# EAGLE design untitled (EAGLE 9.6.2)
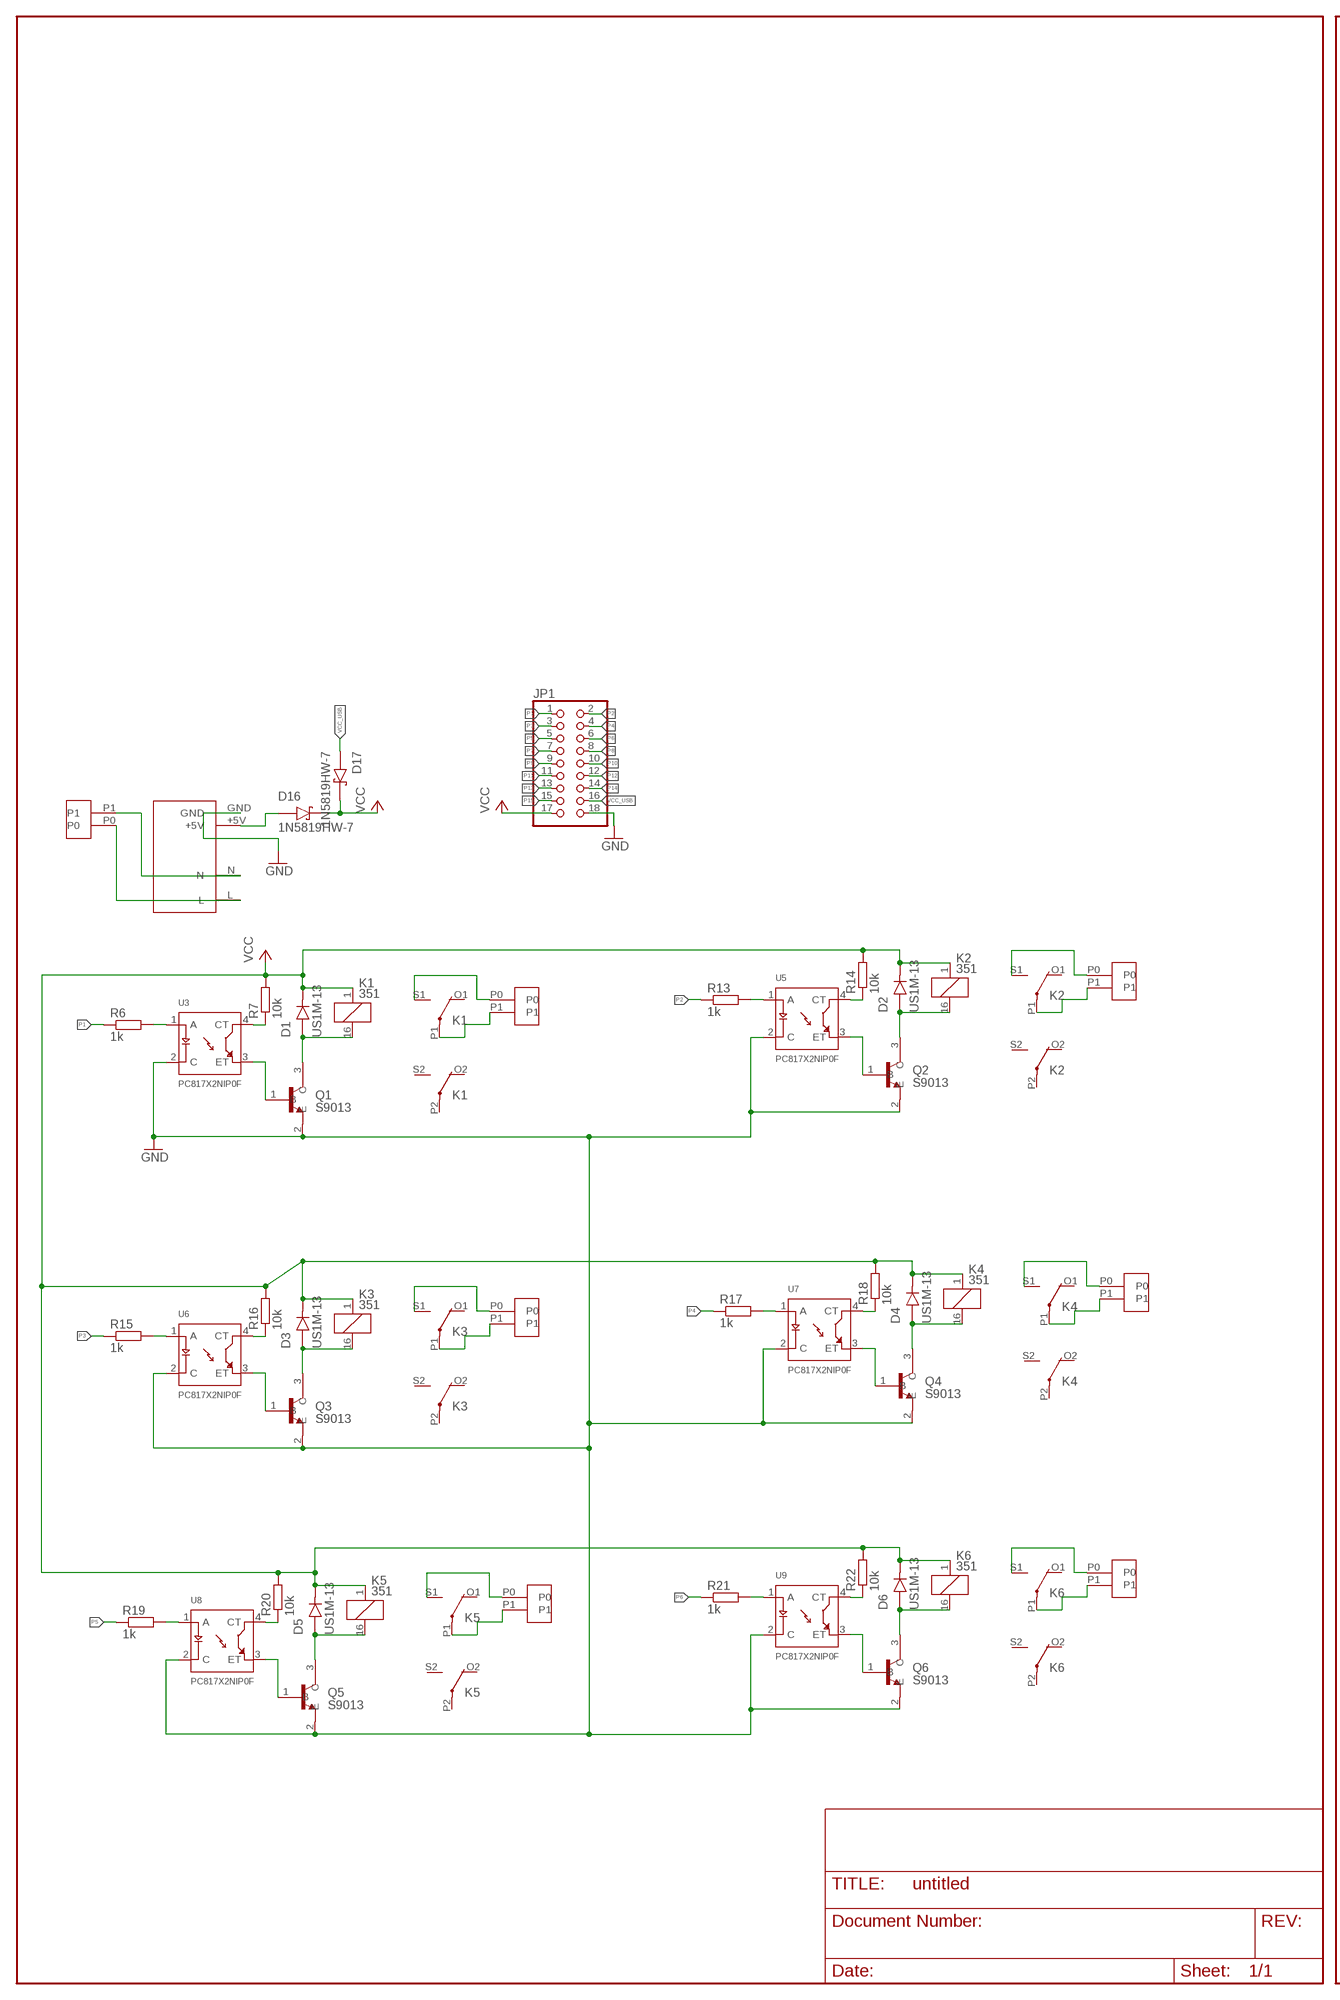
[diagram p0: schematic, sheet 1, part 1 of 2]
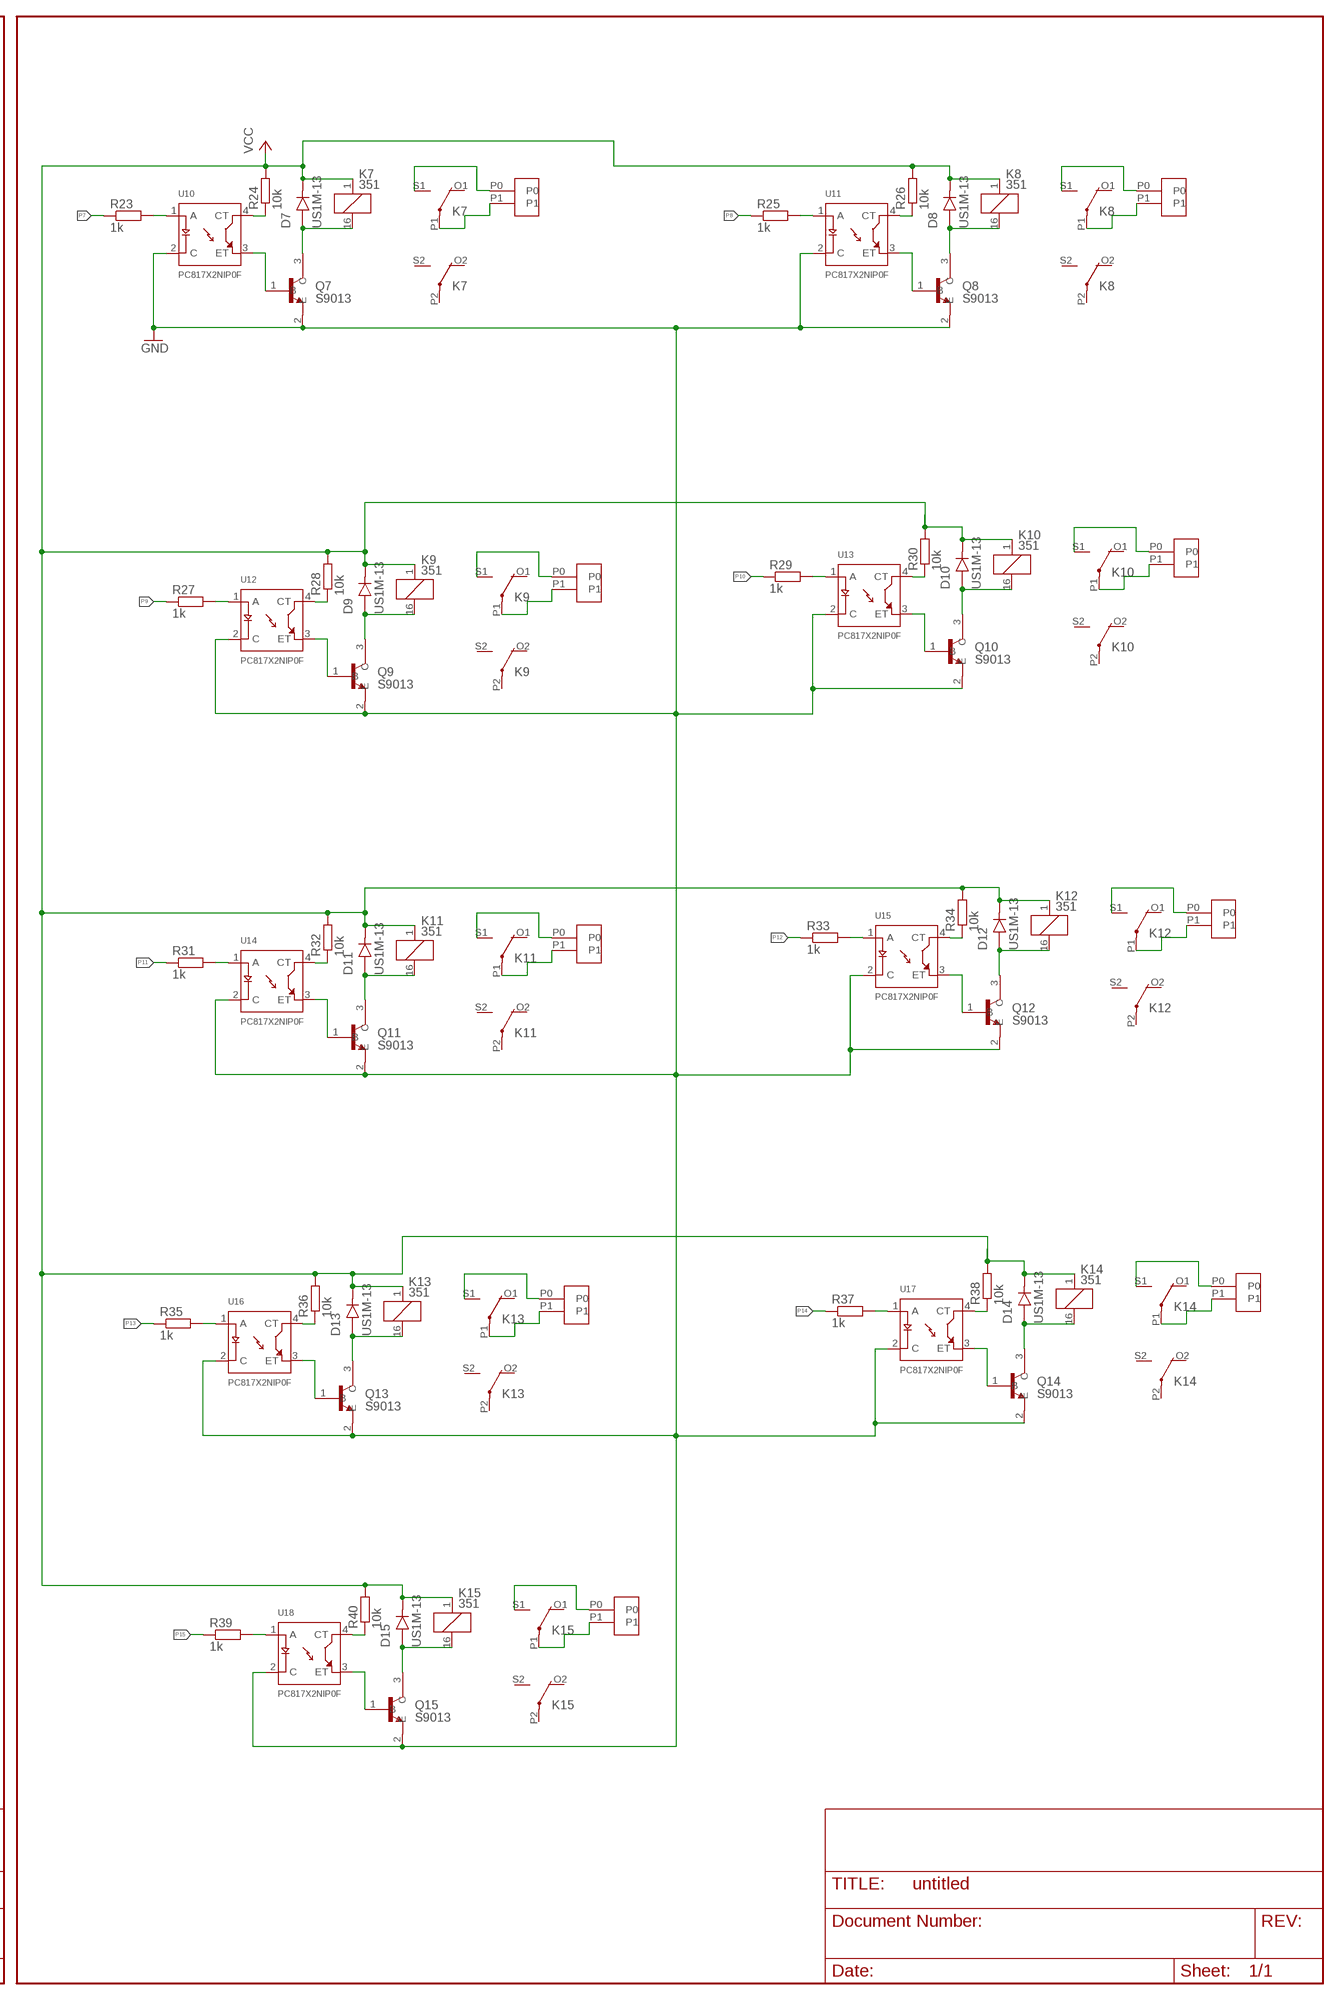
[diagram p1: schematic, sheet 1, part 2 of 2]

## Parts
CONN2P-3.5PI1  CONN2P-3.5PI  [CONN2P-3.5PI]
CONN2P-3.5PI2  CONN2P-3.5PI  [CONN2P-3.5PI]
CONN2P-3.5PI3  CONN2P-3.5PI  [CONN2P-3.5PI]
CONN2P-3.5PI4  CONN2P-3.5PI  [CONN2P-3.5PI]
CONN2P-3.5PI5  CONN2P-3.5PI  [CONN2P-3.5PI]
CONN2P-3.5PI6  CONN2P-3.5PI  [CONN2P-3.5PI]
CONN2P-3.5PI7  CONN2P-3.5PI  [CONN2P-3.5PI]
CONN2P-3.5PI8  CONN2P-3.5PI  [CONN2P-3.5PI]
CONN2P-3.5PI9  CONN2P-3.5PI  [CONN2P-3.5PI]
CONN2P-3.5PI10  CONN2P-3.5PI  [CONN2P-3.5PI]
CONN2P-3.5PI11  CONN2P-3.5PI  [CONN2P-3.5PI]
CONN2P-3.5PI12  CONN2P-3.5PI  [CONN2P-3.5PI]
CONN2P-3.5PI13  CONN2P-3.5PI  [CONN2P-3.5PI]
CONN2P-3.5PI14  CONN2P-3.5PI  [CONN2P-3.5PI]
CONN2P-3.5PI15  CONN2P-3.5PI  [CONN2P-3.5PI]
CONN2P-3.5PI16  CONN2P-3.5PI  [CONN2P-3.5PI]
D1  US1M-13  [DIOM5226X240N]
D2  US1M-13  [DIOM5226X240N]
D3  US1M-13  [DIOM5226X240N]
D4  US1M-13  [DIOM5226X240N]
D5  US1M-13  [DIOM5226X240N]
D6  US1M-13  [DIOM5226X240N]
D7  US1M-13  [DIOM5226X240N]
D8  US1M-13  [DIOM5226X240N]
D9  US1M-13  [DIOM5226X240N]
D10  US1M-13  [DIOM5226X240N]
D11  US1M-13  [DIOM5226X240N]
D12  US1M-13  [DIOM5226X240N]
D13  US1M-13  [DIOM5226X240N]
D14  US1M-13  [DIOM5226X240N]
D15  US1M-13  [DIOM5226X240N]
D16  1N5819HW-7  [SOD3715X145N]
D17  1N5819HW-7  [SOD3715X145N]
JP1  PINHD-2X9-CBIG  [2X09-CLEANBIG]
K1  351  [351]
K2  351  [351]
K3  351  [351]
K4  351  [351]
K5  351  [351]
K6  351  [351]
K7  351  [351]
K8  351  [351]
K9  351  [351]
K10  351  [351]
K11  351  [351]
K12  351  [351]
K13  351  [351]
K14  351  [351]
K15  351  [351]
Q1  S9013  [SOT95P240X120-3N]
Q2  S9013  [SOT95P240X120-3N]
Q3  S9013  [SOT95P240X120-3N]
Q4  S9013  [SOT95P240X120-3N]
Q5  S9013  [SOT95P240X120-3N]
Q6  S9013  [SOT95P240X120-3N]
Q7  S9013  [SOT95P240X120-3N]
Q8  S9013  [SOT95P240X120-3N]
Q9  S9013  [SOT95P240X120-3N]
Q10  S9013  [SOT95P240X120-3N]
Q11  S9013  [SOT95P240X120-3N]
Q12  S9013  [SOT95P240X120-3N]
Q13  S9013  [SOT95P240X120-3N]
Q14  S9013  [SOT95P240X120-3N]
Q15  S9013  [SOT95P240X120-3N]
R6  1k  R-EU_R0805  [R0805]
R7  10k  R-EU_R0805  [R0805]
R13  1k  R-EU_R0805  [R0805]
R14  10k  R-EU_R0805  [R0805]
R15  1k  R-EU_R0805  [R0805]
R16  10k  R-EU_R0805  [R0805]
R17  1k  R-EU_R0805  [R0805]
R18  10k  R-EU_R0805  [R0805]
R19  1k  R-EU_R0805  [R0805]
R20  10k  R-EU_R0805  [R0805]
R21  1k  R-EU_R0805  [R0805]
R22  10k  R-EU_R0805  [R0805]
R23  1k  R-EU_R0805  [R0805]
R24  10k  R-EU_R0805  [R0805]
R25  1k  R-EU_R0805  [R0805]
R26  10k  R-EU_R0805  [R0805]
R27  1k  R-EU_R0805  [R0805]
R28  10k  R-EU_R0805  [R0805]
R29  1k  R-EU_R0805  [R0805]
R30  10k  R-EU_R0805  [R0805]
R31  1k  R-EU_R0805  [R0805]
R32  10k  R-EU_R0805  [R0805]
R33  1k  R-EU_R0805  [R0805]
R34  10k  R-EU_R0805  [R0805]
R35  1k  R-EU_R0805  [R0805]
R36  10k  R-EU_R0805  [R0805]
R37  1k  R-EU_R0805  [R0805]
R38  10k  R-EU_R0805  [R0805]
R39  1k  R-EU_R0805  [R0805]
R40  10k  R-EU_R0805  [R0805]
U3  PC817X2NIP0F  [SOT254P975X400-4N]
U5  PC817X2NIP0F  [SOT254P975X400-4N]
U6  PC817X2NIP0F  [SOT254P975X400-4N]
U7  PC817X2NIP0F  [SOT254P975X400-4N]
U8  PC817X2NIP0F  [SOT254P975X400-4N]
U9  PC817X2NIP0F  [SOT254P975X400-4N]
U10  PC817X2NIP0F  [SOT254P975X400-4N]
U11  PC817X2NIP0F  [SOT254P975X400-4N]
U12  PC817X2NIP0F  [SOT254P975X400-4N]
U13  PC817X2NIP0F  [SOT254P975X400-4N]
U14  PC817X2NIP0F  [SOT254P975X400-4N]
U15  PC817X2NIP0F  [SOT254P975X400-4N]
U16  PC817X2NIP0F  [SOT254P975X400-4N]
U17  PC817X2NIP0F  [SOT254P975X400-4N]
U18  PC817X2NIP0F  [SOT254P975X400-4N]
WX-DC1  WX-DC12003  [WX-DC12003]

## Nets
GND: JP1.18 Q1.2(E) Q2.2(E) Q3.2(E) Q4.2(E) Q5.2(E) Q6.2(E) Q7.2(E) Q8.2(E) Q9.2(E) Q10.2(E) Q11.2(E) Q12.2(E) Q13.2(E) Q14.2(E) Q15.2(E) U3.2(C) U5.2(C) U6.2(C) U7.2(C) U8.2(C) U9.2(C) U10.2(C) U11.2(C) U12.2(C) U13.2(C) U14.2(C) U15.2(C) U16.2(C) U17.2(C) U18.2(C) WX-DC1.GND
N$1: CONN2P-3.5PI1.P1 WX-DC1.N
N$2: CONN2P-3.5PI1.P0 WX-DC1.L
N$3: D16.A WX-DC1.+5V
N$6: R6.2 U3.1(A)
N$7: R7.1 U3.4(CT)
N$8: Q1.1(B) U3.3(ET)
N$10: D1.A K1.16 Q1.3(C)
N$11: CONN2P-3.5PI15.P1 K1.P1(2:P)
N$12: CONN2P-3.5PI15.P0 K1.S1(2:S)
N$15: R13.2 U5.1(A)
N$16: R14.1 U5.4(CT)
N$17: Q2.1(B) U5.3(ET)
N$18: D2.A K2.16 Q2.3(C)
N$19: CONN2P-3.5PI16.P1 K2.P1(2:P)
N$20: CONN2P-3.5PI16.P0 K2.S1(2:S)
N$21: R15.2 U6.1(A)
N$22: R16.1 U6.4(CT)
N$23: Q3.1(B) U6.3(ET)
N$24: D3.A K3.16 Q3.3(C)
N$25: CONN2P-3.5PI2.P1 K3.P1(2:P)
N$26: CONN2P-3.5PI2.P0 K3.S1(2:S)
N$27: R17.2 U7.1(A)
N$28: R18.1 U7.4(CT)
N$29: Q4.1(B) U7.3(ET)
N$30: D4.A K4.16 Q4.3(C)
N$31: CONN2P-3.5PI3.P1 K4.P1(2:P)
N$32: CONN2P-3.5PI3.P0 K4.S1(2:S)
N$33: R19.2 U8.1(A)
N$34: R20.1 U8.4(CT)
N$35: Q5.1(B) U8.3(ET)
N$36: D5.A K5.16 Q5.3(C)
N$37: CONN2P-3.5PI4.P1 K5.P1(2:P)
N$38: CONN2P-3.5PI4.P0 K5.S1(2:S)
N$39: R21.2 U9.1(A)
N$40: R22.1 U9.4(CT)
N$41: Q6.1(B) U9.3(ET)
N$42: D6.A K6.16 Q6.3(C)
N$43: CONN2P-3.5PI5.P1 K6.P1(2:P)
N$44: CONN2P-3.5PI5.P0 K6.S1(2:S)
N$45: R23.2 U10.1(A)
N$46: R24.1 U10.4(CT)
N$47: Q7.1(B) U10.3(ET)
N$48: D7.A K7.16 Q7.3(C)
N$49: CONN2P-3.5PI6.P1 K7.P1(2:P)
N$50: CONN2P-3.5PI6.P0 K7.S1(2:S)
N$51: R25.2 U11.1(A)
N$52: R26.1 U11.4(CT)
N$53: Q8.1(B) U11.3(ET)
N$54: D8.A K8.16 Q8.3(C)
N$55: CONN2P-3.5PI7.P1 K8.P1(2:P)
N$56: CONN2P-3.5PI7.P0 K8.S1(2:S)
N$57: R27.2 U12.1(A)
N$58: R28.1 U12.4(CT)
N$59: Q9.1(B) U12.3(ET)
N$60: D9.A K9.16 Q9.3(C)
N$61: CONN2P-3.5PI8.P1 K9.P1(2:P)
N$62: CONN2P-3.5PI8.P0 K9.S1(2:S)
N$63: R29.2 U13.1(A)
N$64: R30.1 U13.4(CT)
N$65: Q10.1(B) U13.3(ET)
N$66: D10.A K10.16 Q10.3(C)
N$67: CONN2P-3.5PI9.P1 K10.P1(2:P)
N$68: CONN2P-3.5PI9.P0 K10.S1(2:S)
N$69: R31.2 U14.1(A)
N$70: R32.1 U14.4(CT)
N$71: Q11.1(B) U14.3(ET)
N$72: D11.A K11.16 Q11.3(C)
N$73: CONN2P-3.5PI10.P1 K11.P1(2:P)
N$74: CONN2P-3.5PI10.P0 K11.S1(2:S)
N$75: R33.2 U15.1(A)
N$76: R34.1 U15.4(CT)
N$77: Q12.1(B) U15.3(ET)
N$78: D12.A K12.16 Q12.3(C)
N$79: CONN2P-3.5PI11.P1 K12.P1(2:P)
N$80: CONN2P-3.5PI11.P0 K12.S1(2:S)
N$81: R35.2 U16.1(A)
N$82: R36.1 U16.4(CT)
N$83: Q13.1(B) U16.3(ET)
N$84: D13.A K13.16 Q13.3(C)
N$85: CONN2P-3.5PI12.P1 K13.P1(2:P)
N$86: CONN2P-3.5PI12.P0 K13.S1(2:S)
N$87: R37.2 U17.1(A)
N$88: R38.1 U17.4(CT)
N$89: Q14.1(B) U17.3(ET)
N$90: D14.A K14.16 Q14.3(C)
N$91: CONN2P-3.5PI13.P1 K14.P1(2:P)
N$92: CONN2P-3.5PI13.P0 K14.S1(2:S)
N$93: R39.2 U18.1(A)
N$94: R40.1 U18.4(CT)
N$95: Q15.1(B) U18.3(ET)
N$96: D15.A K15.16 Q15.3(C)
N$97: CONN2P-3.5PI14.P1 K15.P1(2:P)
N$98: CONN2P-3.5PI14.P0 K15.S1(2:S)
P1: JP1.1 R6.1
P2: JP1.2 R13.1
P3: JP1.3 R15.1
P4: JP1.4 R17.1
P5: JP1.5 R19.1
P6: JP1.6 R21.1
P7: JP1.7 R23.1
P8: JP1.8 R25.1
P9: JP1.9 R27.1
P10: JP1.10 R29.1
P11: JP1.11 R31.1
P12: JP1.12 R33.1
P13: JP1.13 R35.1
P14: JP1.14 R37.1
P15: JP1.15 R39.1
VCC: D1.C(K) D2.C(K) D3.C(K) D4.C(K) D5.C(K) D6.C(K) D7.C(K) D8.C(K) D9.C(K) D10.C(K) D11.C(K) D12.C(K) D13.C(K) D14.C(K) D15.C(K) D16.C(K) D17.C(K) JP1.17 K1.1 K2.1 K3.1 K4.1 K5.1 K6.1 K7.1 K8.1 K9.1 K10.1 K11.1 K12.1 K13.1 K14.1 K15.1 R7.2 R14.2 R16.2 R18.2 R20.2 R22.2 R24.2 R26.2 R28.2 R30.2 R32.2 R34.2 R36.2 R38.2 R40.2
VCC_USB: D17.A JP1.16
Unconnected: K1.O1(2:O) K1.O2(3:O) K1.P2(3:P) K1.S2(3:S) K2.O1(2:O) K2.O2(3:O) K2.P2(3:P) K2.S2(3:S) K3.O1(2:O) K3.O2(3:O) K3.P2(3:P) K3.S2(3:S) K4.O1(2:O) K4.O2(3:O) K4.P2(3:P) K4.S2(3:S) K5.O1(2:O) K5.O2(3:O) K5.P2(3:P) K5.S2(3:S) K6.O1(2:O) K6.O2(3:O) K6.P2(3:P) K6.S2(3:S) K7.O1(2:O) K7.O2(3:O) K7.P2(3:P) K7.S2(3:S) K8.O1(2:O) K8.O2(3:O) K8.P2(3:P) K8.S2(3:S) K9.O1(2:O) K9.O2(3:O) K9.P2(3:P) K9.S2(3:S) K10.O1(2:O) K10.O2(3:O) K10.P2(3:P) K10.S2(3:S) K11.O1(2:O) K11.O2(3:O) K11.P2(3:P) K11.S2(3:S) K12.O1(2:O) K12.O2(3:O) K12.P2(3:P) K12.S2(3:S) K13.O1(2:O) K13.O2(3:O) K13.P2(3:P) K13.S2(3:S) K14.O1(2:O) K14.O2(3:O) K14.P2(3:P) K14.S2(3:S) K15.O1(2:O) K15.O2(3:O) K15.P2(3:P) K15.S2(3:S)

## Library data of the parts
CONN2P-3.5PI1-CONN2P-3.5PI16 = CONN2P-3.5PI:CONN2P-3.5PI
D1-D15 = US1M-13:US1M-13: Diode, Fast Recovery, 1a, 1kv, Do-214ac-2, Full Reel Check availability <https://pricing.snapeda.com/parts/US1M-13/Diodes%20Incorporated/view-part?ref=eda>; AVAILABILITY: In Stock; DESCRIPTION: Diode Standard 1000 V 1A Surface Mount SMA; MF: Diodes Incorporated; MP: US1M-13; PACKAGE: DO-214AC-214 Diodes Incorporated; PRICE: None; PURCHASE-URL: https://pricing.snapeda.com/search/part/US1M-13/?ref=eda
D16 D17 = 1N5819HW-7:1N5819HW-7: 1N5819HW Series 40 V 1 A Surface Mount Schottky Barrier Rectifier - SOD-123 Check availability <https://pricing.snapeda.com/parts/1N5819HW-7/Diodes%20Inc./view-part?ref=eda>; AVAILABILITY: In Stock; DESCRIPTION: Diode Schottky 40 V 1A Surface Mount SOD-123; MF: Diodes Inc.; MP: 1N5819HW-7; PACKAGE: SOD-123 Fairchild Semiconductor; PRICE: None; PURCHASE-URL: https://pricing.snapeda.com/search/part/1N5819HW-7/?ref=eda
JP1 = adafruit:PINHD-2X9: PIN HEADER With larger annulars
K1-K15 = relay:351: RELAY 2 x switch, Omron; OC_FARNELL: unknown; OC_NEWARK: unknown
Q1-Q15 = S9013:S9013: SMD Transistors NPN 25V-500mA Check availability <https://pricing.snapeda.com/parts/S9013/JCET/view-part?ref=eda>; AVAILABILITY: In Stock; DESCRIPTION: Bipolar (BJT) Transistor NPN 20V 500mA 625mW Through Hole TO-92-3; MF: JCET; MP: S9013; PACKAGE: SOT-23-3 JCET; PRICE: None; PURCHASE-URL: https://pricing.snapeda.com/search/part/S9013/?ref=eda
R6 R7 R13-R40 = rcl:R-EU_: RESISTOR, European symbol; SPICEPREFIX: R
U3 U5-U18 = PC817X2NIP0F:PC817X2NIP0F: PC817 Series 1 Channel 80 V 5000 Vrms General Purpose Photocoupler - DIP-4 Check availability <https://pricing.snapeda.com/parts/PC817X2NIP0F/Sharp%20Microelectronics/view-part?ref=eda>; AVAILABILITY: Not in stock; DESCRIPTION: Optoisolator Transistor Output 5000Vrms 1 Channel 4-SMD; MF: Sharp Microelectronics; MP: PC817X2NIP0F; PACKAGE: SMD-4 Sharp Microelectronics; PRICE: None
WX-DC1 = WX-DC12003:WX-DC12003

## Board
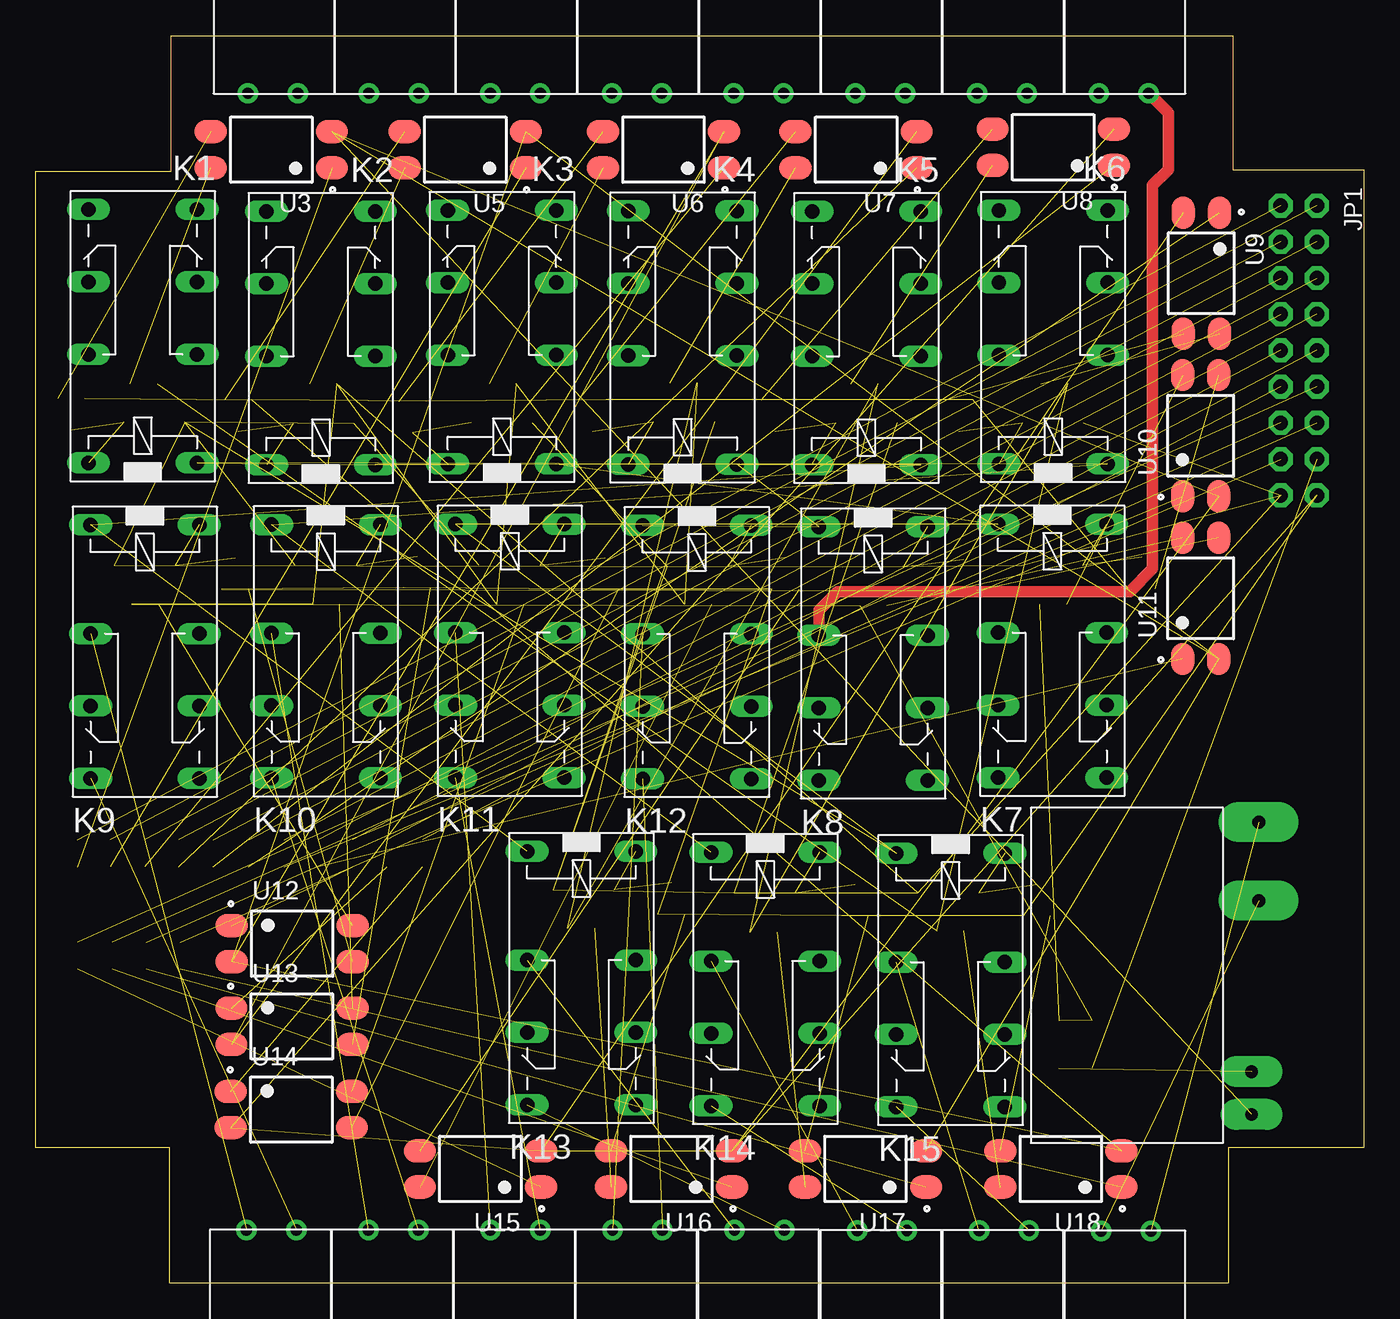
[diagram p2: board, top side]
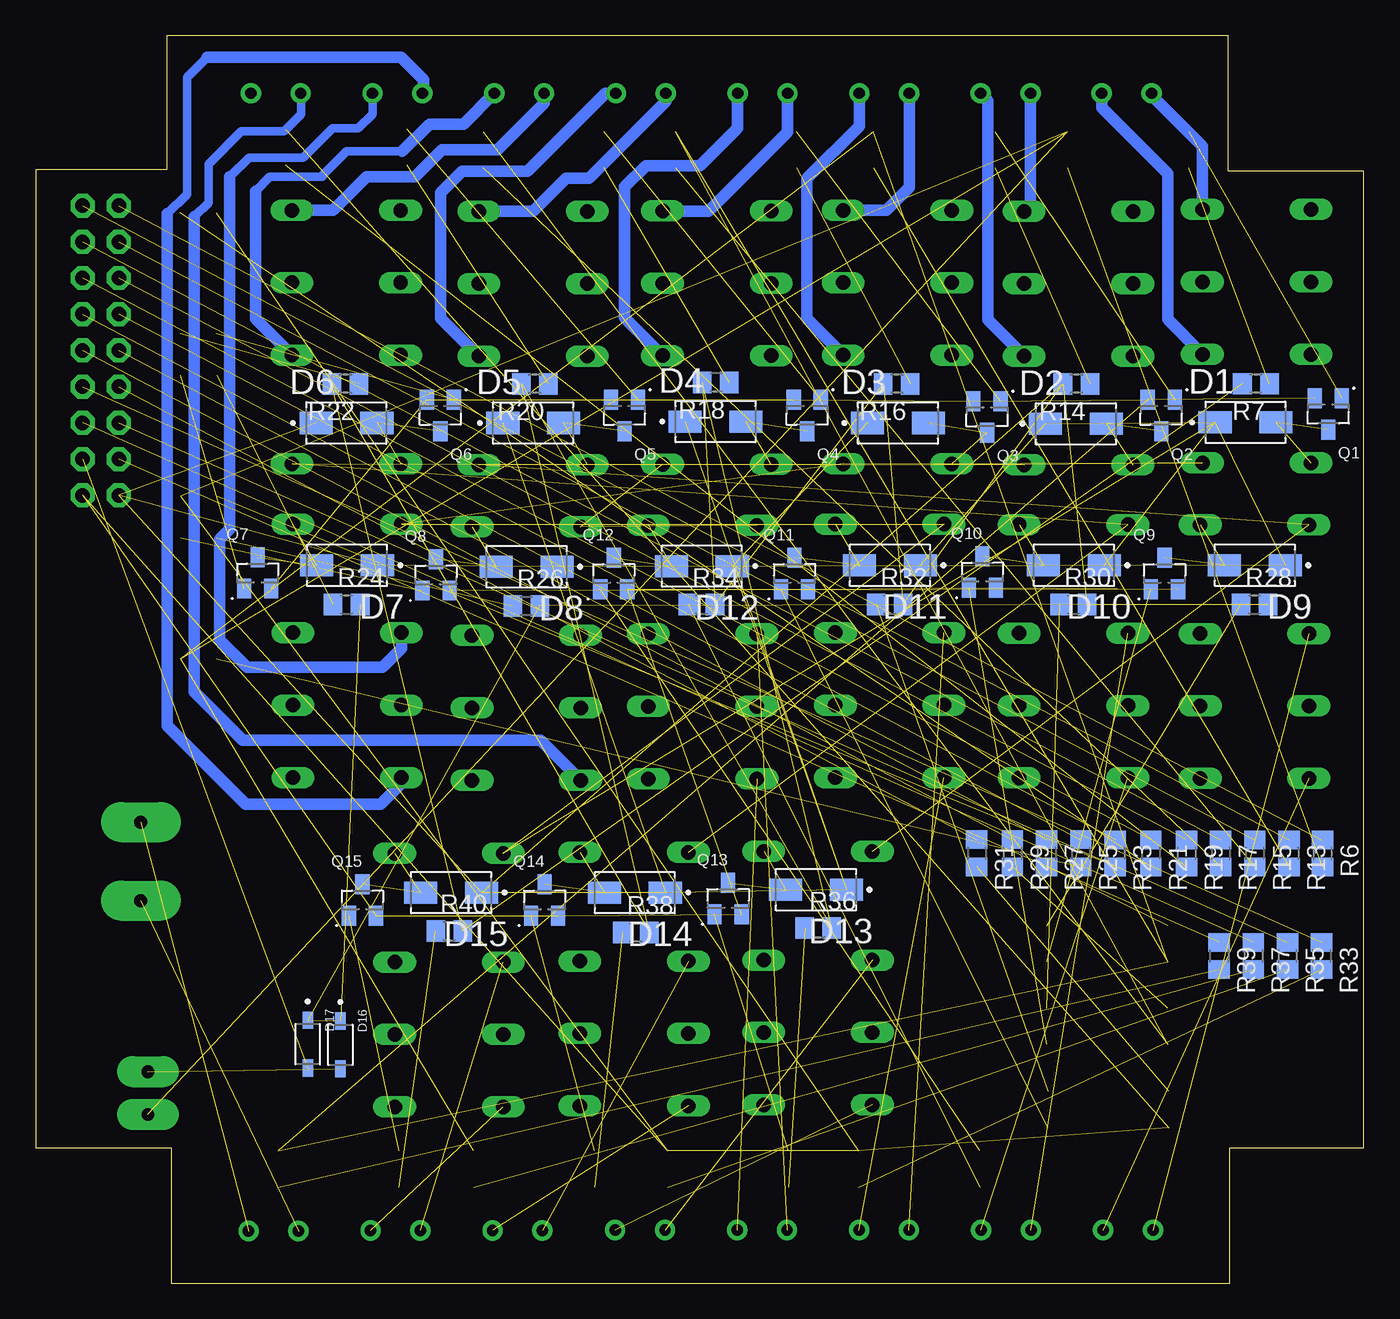
[diagram p3: board, bottom side, seen from below]

Size 93.2 x 87.5 mm. Coordinates in mm from the lower left corner, seen from the top.
Outline: 0,78 9.5,78 9.5,87.5 84,87.5 84,78.1 93.2,78.1 93.2,9.5 83.7,9.5 83.7,0 9.4,0 9.4,9.5 0,9.5 0,78
Copper layers (1*16): Top 0.035mm / dielectric 1.5mm / Bottom 0.035mm
Design rules "default": minimum track width 6mil, minimum drill 0.35mm, track to track 6mil, track to pad 6mil, pad to pad 6mil, via to via 6mil, smd to smd 6mil, copper to edge 40mil, drill to drill 6mil, minimum pad ring 10mil, minimum via ring 8mil, stop-mask expansion 4mil, vias tented up to drill 0mil, thermal gap 10mil

### Footprints (pad centres in the part's own frame; a part is rotated, then mirrored left to right if it is on the bottom)
CONN2P-3.5PI = drill 0.8 pad 1.422: P0 2.421,0.016; P1 5.921,0.016
DIOM5226X240N = smd 2.33 x 1.55: A 2.135,0; C -2.135,0
SOD3715X145N = smd 1.21 x 0.73: A 1.68,0; C -1.68,0
2X09-CLEANBIG = drill 1.016 pad 1.676 octagon: 1 -10.16,-1.27; 2 -10.16,1.27; 3 -7.62,-1.27; 4 -7.62,1.27; 5 -5.08,-1.27; 6 -5.08,1.27; 7 -2.54,-1.27; 8 -2.54,1.27; 9 0,-1.27; 10 0,1.27; 11 2.54,-1.27; 12 2.54,1.27; 13 5.08,-1.27; 14 5.08,1.27; 15 7.62,-1.27; 16 7.62,1.27; 17 10.16,-1.27; 18 10.16,1.27
351 = drill 1.016 long: 1 -3.81,-3.81; 16 -3.81,3.81; O1 8.89,-3.81; O2 8.89,3.81; P1 3.81,-3.81; P2 3.81,3.81; S1 13.97,-3.81; S2 13.97,3.81
SOT95P240X120-3N = smd 1 x 1.4: 1 -0.95,-1.1; 2 0.95,-1.1; 3 0,1.1
R0805 = smd 1.3 x 1.5: 1 -0.95,0; 2 0.95,0
SOT254P975X400-4N = smd 2.25 x 1.6: 1 -4.25,1.27; 2 -4.25,-1.27; 3 4.25,-1.27; 4 4.25,1.27
WX-DC12003 = drill 0.9 pad 2.184 long: +5V 3,-14.5; GND 0,-14.5 | drill 0.9 pad 2.8 long: L 20.5,-15; N 15,-15

### Placement (x,y rotation side)
CONN2P-3.5PI1  80.68,3.67 180 top
CONN2P-3.5PI2  29.48,83.44 0 top
CONN2P-3.5PI3  38.02,83.44 0 top
CONN2P-3.5PI4  46.56,83.44 0 top
CONN2P-3.5PI5  55.1,83.44 0 top
CONN2P-3.5PI6  63.64,83.44 0 top
CONN2P-3.5PI7  72.18,83.44 0 top
CONN2P-3.5PI8  20.72,3.74 180 top
CONN2P-3.5PI9  29.28,3.74 180 top
CONN2P-3.5PI10  37.84,3.74 180 top
CONN2P-3.5PI11  46.4,3.74 180 top
CONN2P-3.5PI12  54.96,3.74 180 top
CONN2P-3.5PI13  63.56,3.71 180 top
CONN2P-3.5PI14  72.12,3.71 180 top
CONN2P-3.5PI15  12.48,83.44 0 top
CONN2P-3.5PI16  20.97,83.44 0 top
D1  8.31,60.37 0 bottom
D2  20.21,60.27 0 bottom
D3  32.69,60.33 0 bottom
D4  45.49,60.43 0 bottom
D5  58.29,60.33 0 bottom
D6  71.39,60.33 0 bottom
D7  71.35,50.35 180 bottom
D8  58.75,50.25 180 bottom
D9  7.65,50.35 180 bottom
D10  20.35,50.35 180 bottom
D11  33.25,50.35 180 bottom
D12  46.45,50.29 180 bottom
D13  38.45,27.59 180 bottom
D14  51.15,27.39 180 bottom
D15  64.05,27.39 180 bottom
D16  71.81,16.71 270 bottom
D17  74.11,16.76 270 bottom
JP1  88.63,65.42 270 top
K1  7.52,61.34 90 top
K2  20.02,61.21 90 top
K3  32.72,61.28 90 top
K4  45.4,61.24 90 top
K5  58.3,61.21 90 top
K6  71.4,61.28 90 top
K7  71.34,49.43 270 top
K8  58.77,49.24 270 top
K9  7.67,49.37 270 top
K10  20.37,49.4 270 top
K11  33.27,49.43 270 top
K12  46.4,49.34 270 top
K13  38.3,26.47 270 top
K14  51.2,26.4 270 top
K15  64.2,26.33 270 top
Q1  2.5,60.96 180 bottom
Q2  14.22,60.86 180 bottom
Q3  26.44,60.76 180 bottom
Q4  39.06,60.86 180 bottom
Q5  51.88,60.86 180 bottom
Q6  64.8,60.86 180 bottom
Q7  77.62,49.82 0 bottom
Q8  65.11,49.68 0 bottom
Q9  13.99,49.78 0 bottom
Q10  26.77,49.88 0 bottom
Q11  39.95,49.78 0 bottom
Q12  52.63,49.78 0 bottom
Q13  44.61,26.98 0 bottom
Q14  57.49,26.88 0 bottom
Q15  70.27,26.88 0 bottom
R6  2.91,30.13 270 bottom
R7  7.58,63.08 180 bottom
R13  5.25,30.14 270 bottom
R14  20.17,63.07 180 bottom
R15  7.65,30.14 270 bottom
R16  32.77,63.07 180 bottom
R17  10.05,30.14 270 bottom
R18  45.47,63.17 180 bottom
R19  12.45,30.14 270 bottom
R20  58.17,63.07 180 bottom
R21  14.95,30.14 270 bottom
R22  71.47,63.07 180 bottom
R23  17.45,30.14 270 bottom
R24  71.38,47.6 0 bottom
R25  19.86,30.15 270 bottom
R26  58.78,47.5 0 bottom
R27  22.26,30.15 270 bottom
R28  7.68,47.6 0 bottom
R29  24.66,30.15 270 bottom
R30  20.38,47.6 0 bottom
R31  27.16,30.15 270 bottom
R32  33.28,47.6 0 bottom
R33  2.96,22.95 270 bottom
R34  46.48,47.6 0 bottom
R35  5.36,22.95 270 bottom
R36  38.28,24.9 0 bottom
R37  7.76,22.95 270 bottom
R38  51.08,24.6 0 bottom
R39  10.16,22.95 270 bottom
R40  64.18,24.7 0 bottom
U3  16.54,79.5 180 top
U5  30.15,79.5 180 top
U6  44.06,79.5 180 top
U7  57.57,79.5 180 top
U8  71.4,79.67 180 top
U9  81.79,70.83 270 top
U10  81.75,59.44 90 top
U11  81.75,48.03 90 top
U12  18,23.81 0 top
U13  17.99,18.01 0 top
U14  17.94,12.17 0 top
U15  31.21,8.01 180 top
U16  44.62,8.01 180 top
U17  58.23,8.01 180 top
U18  71.94,8.01 180 top
WX-DC1  70.82,11.83 90 top

### Tracks (layer width: path | path; a pad name or v marks a point on that pad's centre or on a via)
GND  (31 unrouted)
N$1  (1 unrouted)
N$2  (1 unrouted)
N$3  (1 unrouted)
N$6  (1 unrouted)
N$7  (1 unrouted)
N$8  (1 unrouted)
N$10  (2 unrouted)
N$11
  Bottom 0.813: K1.P1 13.77,67.59 13.77,77.82 18.4,82.46 CONN2P-3.5PI15.P1
N$12
  Bottom 0.813: K1.S1 11.33,79.75 14.9,83.32 CONN2P-3.5PI15.P0
N$15  (1 unrouted)
N$16  (1 unrouted)
N$17  (1 unrouted)
N$18  (2 unrouted)
N$19
  Bottom 0.813: K2.P1 26.37,67.56 26.37,82.93 CONN2P-3.5PI16.P1
N$20
  Bottom 0.813: K2.S1 23.39,75.62 CONN2P-3.5PI16.P0
N$21  (1 unrouted)
N$22  (1 unrouted)
N$23  (1 unrouted)
N$24  (2 unrouted)
N$25
  Bottom 0.813: K3.P1 39.07,67.63 39.07,77.49 35.4,81.16 CONN2P-3.5PI2.P1
N$26
  Bottom 0.813: K3.S1 33.51,75.25 31.9,76.86 CONN2P-3.5PI2.P0
N$27  (1 unrouted)
N$28  (1 unrouted)
N$29  (1 unrouted)
N$30  (2 unrouted)
N$31
  Bottom 0.813: K4.P1 51.87,67.71 51.87,76.89 50.37,78.39 46.57,78.39 43.94,81.02 CONN2P-3.5PI3.P1
N$32
  Bottom 0.813: CONN2P-3.5PI3.P0 40.44,80.72 45.97,75.19 49.19,75.19 K4.S1
N$33  (1 unrouted)
N$34  (1 unrouted)
N$35  (1 unrouted)
N$36  (2 unrouted)
N$37
  Bottom 0.813: K5.P1 64.77,67.68 64.77,76.49 63.27,77.99 58.67,77.99 53.2,83.46 CONN2P-3.5PI4.P1
N$38
  Bottom 0.813: K5.S1 58.28,75.18 55.97,77.49 54.37,77.49 48.97,82.89 48.97,83.44 CONN2P-3.5PI4.P0
N$39  (1 unrouted)
N$40  (1 unrouted)
N$41  (1 unrouted)
N$42  (2 unrouted)
N$43
  Bottom 0.61: 67.47,79.39 71.37,79.39 72.77,77.99 73.07,77.69 73.17,77.59 | 73.07,77.59 73.17,77.59 | 77.77,76.59 76.77,77.59 73.57,77.59 73.17,77.59
  Bottom 0.813: K6.P1 77.77,67.65 77.77,76.59 | 67.47,79.39 65.57,81.29 63.19,81.29 CONN2P-3.5PI5.P1
N$44
  Bottom 0.813: K6.S1 72.31,75.25 69.97,77.59 66.57,77.59 64.67,79.49 60.79,79.49 57.52,82.76 CONN2P-3.5PI5.P0
N$45  (1 unrouted)
N$46  (1 unrouted)
N$47  (1 unrouted)
N$48  (2 unrouted)
N$49
  Bottom 0.61: 79.57,77.59 78.22,78.94 74.42,78.94 72.37,80.99 70.57,80.99 69.56,82 CONN2P-3.5PI6.P1
  Bottom 0.813: K7.P1 67.53,44.53 68.87,43.19 78.37,43.19 80.27,45.09 80.27,52.19 79.57,52.89 79.57,77.59
N$50
  Bottom 0.61: 81.17,85.99 82.57,84.59 82.57,76.39 83.97,74.99
  Bottom 0.813: K7.S1 67.53,35.06 69,33.59 78.47,33.59 83.97,39.09 83.97,74.99 | 81.17,85.99 67.57,85.99 65.97,84.39 65.97,83.55 CONN2P-3.5PI6.P0
N$51  (1 unrouted)
N$52  (1 unrouted)
N$53  (1 unrouted)
N$54  (2 unrouted)
N$55
  Top 0.813: K8.P1 54.96,47.18 56.27,48.49 76.77,48.49 78.37,50.09 78.37,76.99 79.47,78.09 79.47,82.09 CONN2P-3.5PI7.P1
N$56
  Bottom 0.61: 82.07,74.79 81.07,75.79 81.07,78.49 78.77,80.79 75.77,80.79 74.57,81.99 74.57,83.42
  Bottom 0.813: K8.S1 57.78,38.09 78.67,38.09 82.07,41.49 82.07,74.79 | 74.57,83.42 CONN2P-3.5PI7.P0
N$57  (1 unrouted)
N$58  (1 unrouted)
N$59  (1 unrouted)
N$60  (2 unrouted)
N$61  (1 unrouted)
N$62  (1 unrouted)
N$63  (1 unrouted)
N$64  (1 unrouted)
N$65  (1 unrouted)
N$66  (2 unrouted)
N$67  (1 unrouted)
N$68  (1 unrouted)
N$69  (1 unrouted)
N$70  (1 unrouted)
N$71  (1 unrouted)
N$72  (2 unrouted)
N$73  (1 unrouted)
N$74  (1 unrouted)
N$75  (1 unrouted)
N$76  (1 unrouted)
N$77  (1 unrouted)
N$78  (2 unrouted)
N$79  (1 unrouted)
N$80  (1 unrouted)
N$81  (1 unrouted)
N$82  (1 unrouted)
N$83  (1 unrouted)
N$84  (2 unrouted)
N$85  (1 unrouted)
N$86  (1 unrouted)
N$87  (1 unrouted)
N$88  (1 unrouted)
N$89  (1 unrouted)
N$90  (2 unrouted)
N$91  (1 unrouted)
N$92  (1 unrouted)
N$93  (1 unrouted)
N$94  (1 unrouted)
N$95  (1 unrouted)
N$96  (2 unrouted)
N$97  (1 unrouted)
N$98  (1 unrouted)
P1  (1 unrouted)
P2  (1 unrouted)
P3  (1 unrouted)
P4  (1 unrouted)
P5  (1 unrouted)
P6  (1 unrouted)
P7  (1 unrouted)
P8  (1 unrouted)
P9  (1 unrouted)
P10  (1 unrouted)
P11  (1 unrouted)
P12  (1 unrouted)
P13  (1 unrouted)
P14  (1 unrouted)
P15  (1 unrouted)
VCC  (47 unrouted)
VCC_USB  (1 unrouted)